# EAGLE design oresat1b-minusz-end-cap (EAGLE 9.6.2)
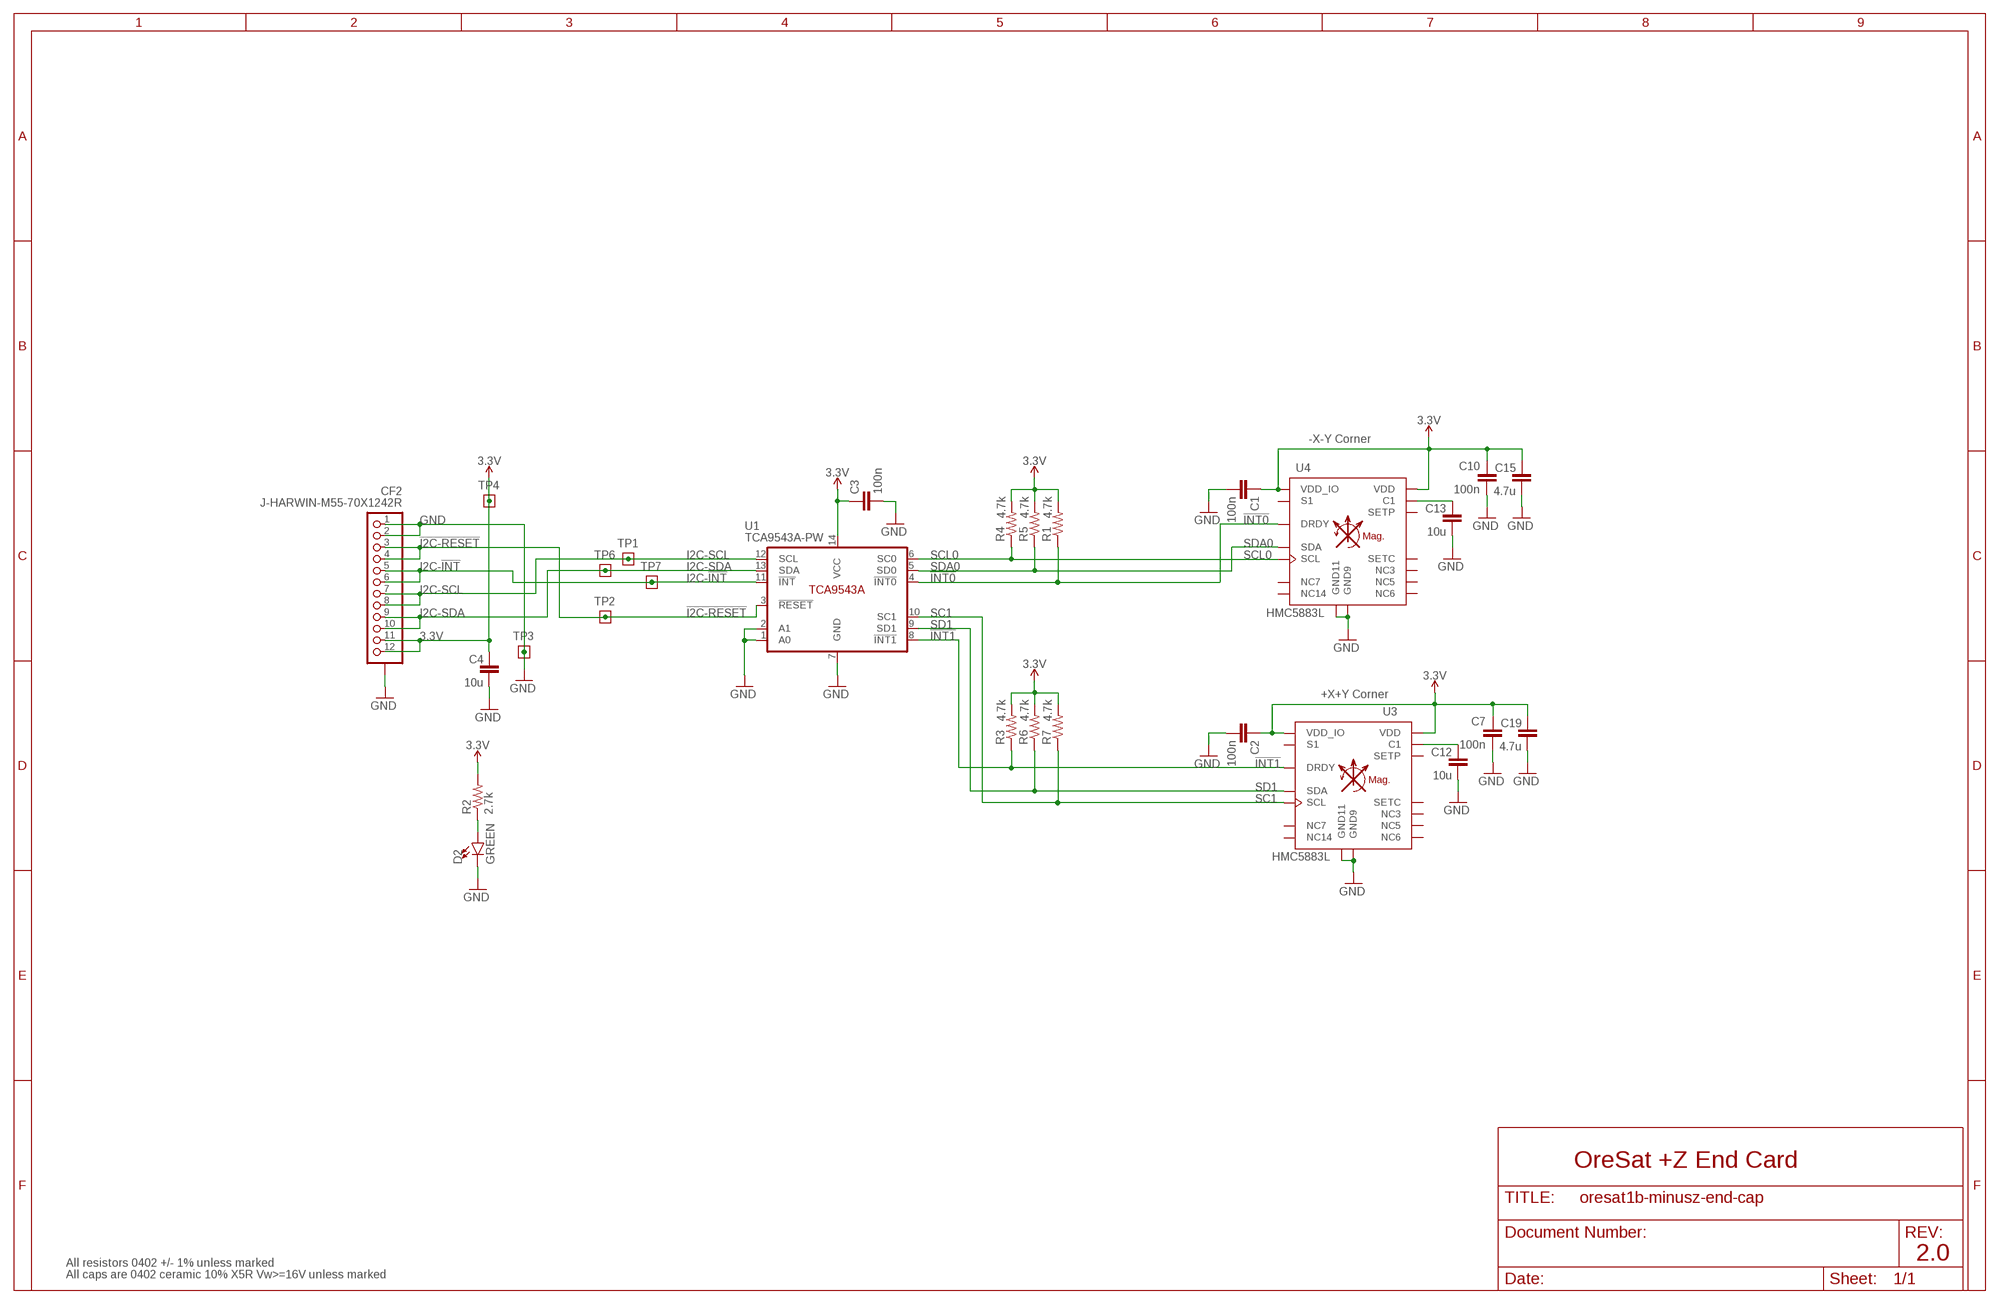
[diagram p0: schematic, sheet 1]

## Parts
C1  100n  C-EU0402-B-NOSILK  [.0402-B-NOSILK]
C2  100n  C-EU0402-B-NOSILK  [.0402-B-NOSILK]
C3  100n  C-EU0402-B-NOSILK  [.0402-B-NOSILK]
C4  10u  C-EU0603-B-NOSILK  [.0603-B-NOSILK]
C7  100n  C-EU0402-B-NOSILK  [.0402-B-NOSILK]
C10  100n  C-EU0402-B-NOSILK  [.0402-B-NOSILK]
C12  10u  C-EU0603-B-NOSILK  [.0603-B-NOSILK]
C13  10u  C-EU0603-B-NOSILK  [.0603-B-NOSILK]
C15  4.7u  C-EU0603-B-NOSILK  [.0603-B-NOSILK]
C19  4.7u  C-EU0603-B-NOSILK  [.0603-B-NOSILK]
CF2  J-HARWIN-M55-70X1242R  [HARWIN-M55-70X1242R]
D2  GREEN  LED-GREEN0603  [LED-0603]
R1  4.7k  R-US_0402-B-NOSILK  [.0402-B-NOSILK]
R2  2.7k  R-US_0402-B-NOSILK  [.0402-B-NOSILK]
R3  4.7k  R-US_0402-B-NOSILK  [.0402-B-NOSILK]
R4  4.7k  R-US_0402-B-NOSILK  [.0402-B-NOSILK]
R5  4.7k  R-US_0402-B-NOSILK  [.0402-B-NOSILK]
R6  4.7k  R-US_0402-B-NOSILK  [.0402-B-NOSILK]
R7  4.7k  R-US_0402-B-NOSILK  [.0402-B-NOSILK]
TP1  TEST-POINT  [2MM-TEST-POINT]
TP2  TEST-POINT  [2MM-TEST-POINT]
TP3  TEST-POINT  [2MM-TEST-POINT]
TP4  TEST-POINT  [2MM-TEST-POINT]
TP6  TEST-POINT  [2MM-TEST-POINT]
TP7  TEST-POINT  [2MM-TEST-POINT]
U1  TCA9543A-PW  [TSSOP14-0.65-5.4X4.4MM]
U3  HMC5883L  HMC5883L-LGA-16  [QLGA-16(3X3)]
U4  HMC5883L  HMC5883L-LGA-16  [QLGA-16(3X3)]

## Nets
3.3V: C1.1 C2.1 C3.1 C4.1 C7.1 C10.1 C15.1 C19.1 CF2.11 CF2.12 R1.2 R2.2 R3.2 R4.2 R5.2 R6.2 R7.2 TP4.1 U1.14(VCC) U3.2(VDD) U3.13(VDD_IO) U4.2(VDD) U4.13(VDD_IO)
!I2C-RESET: CF2.3 CF2.4 TP2.1 U1.3(!RESET)
!INT0: R1.1 U1.4(!INT0) U4.15(DRDY)
!INT1: R3.1 U1.8(!INT1) U3.15(DRDY)
GND: C1.2 C2.2 C3.2 C4.2 C7.2 C10.2 C12.2 C13.2 C15.2 C19.2 CF2.1 CF2.2 CF2.P$1(SHIELDS) CF2.P$2(SHIELDS) CF2.P$3(SHIELDS) CF2.P$4(SHIELDS) D2.C TP3.1 U1.1(A0) U1.2(A1) U1.7(GND) U3.9(GND9) U3.11(GND11) U4.9(GND9) U4.11(GND11)
I2C-!INT: CF2.5 CF2.6 TP7.1 U1.11(!INT)
I2C-SCL: CF2.7 CF2.8 TP1.1 U1.12(SCL)
I2C-SDA: CF2.9 CF2.10 TP6.1 U1.13(SDA)
N$2: C12.1 U3.10(C1)
N$5: C13.1 U4.10(C1)
N$271: D2.A R2.1
SC1: R7.1 U1.10(SC1) U3.1(SCL)
SCL0: R4.1 U1.6(SC0) U4.1(SCL)
SD1: R6.1 U1.9(SD1) U3.16(SDA)
SDA0: R5.1 U1.5(SD0) U4.16(SDA)
Unconnected: U3.3(NC3) U3.4(S1) U3.5(NC5) U3.6(NC6) U3.7(NC7) U3.8(SETP) U3.12(SETC) U3.14(NC14) U4.3(NC3) U4.4(S1) U4.5(NC5) U4.6(NC6) U4.7(NC7) U4.8(SETP) U4.12(SETC) U4.14(NC14)

## Notes on the sheet
- -X-Y Corner
- +X+Y Corner
- OreSat +Z End Card
- 2.0
- All resistors 0402 +/- 1% unless marked
- All caps are 0402 ceramic 10% X5R Vw>=16V unless marked

## Library data of the parts
C1-C3 C7 C10 = rcl_custom:C-EU: CAPACITOR, European symbol; DIS: Digi-Key; DPN: 1276-1001-1-ND; MFR: Samsung; MPN: CL05B104KO5NNNC
C4 C12 C13 C15 C19 = oresat-rcl:C-EU: CAPACITOR, European symbol; DIS: Digi-Key; DPN: 1276-1001-1-ND; MFR: Samsung; MPN: CL05B104KO5NNNC
CF2 = J-Harwin-M55-70X1242R-12pin-1.27mm-M-vertical:J-HARWIN-M55-70X1242R
D2 = SparkFun-LED:LED-GREEN: Green SMD LED Used in manufacturing of various products at SparkFun Packages: 0603 - SMD 0603 package [Product Link] <http://www.futureelectronics.com/en/technologies/semiconductors/optoelectronics/leds/Pages/9894312-LTST-C190GKT.aspx?CrossPart=HSMG-C190&IM=0> LilyPad 1206 - SMD1206 LilyPad package [Product Link] <http://www.futureelectronics.com/en/Technologies/Product.aspx?ProductID=IN150NGHARVATEKCORPORATION2049943&IM=0> 1206 - SMD1206 package [Product Link] <http://www.futureelectronics.com/en/technologies/semiconductors/optoelectronics/leds/Pages/8315665-LTST-C150KGKT.aspx?IM=0> 1206 Bottom Mount -SMD 1206 Bottom Mount [Product Link] <http://www.digikey.com/product-detail/en/lite-on-inc/LTST-C230KGKT/160-1456-1-ND/386854> SparkFun Products: Pro Mini 328 -5V <https://www.sparkfun.com/products/821> RedBoard <https://www.sparkfun.com/products/12757> MP3 Trigger <https://www.sparkfun.com/products/13720> Makey Makey <https://www.sparkfun.com/products/11076>; PROD_ID: DIO-00821
R1-R7 = rcl_custom:R-US_: RESISTOR, American symbol; DIS: Digi-Key; DPN: 1276-4275-1-ND; MFR: Samsung; MPN: RC1005F6653CS
TP1-TP4 TP6 TP7 = Tova:TEST-POINT
U1 = U-TI-TCA9543A-I2C-2-to-1-multiplexer:TCA9543A-PW
U3 U4 = monitor-v2:HMC5883L: Honeywell HMC5883L 3-axis Digital Compass with I2C interface

## Board
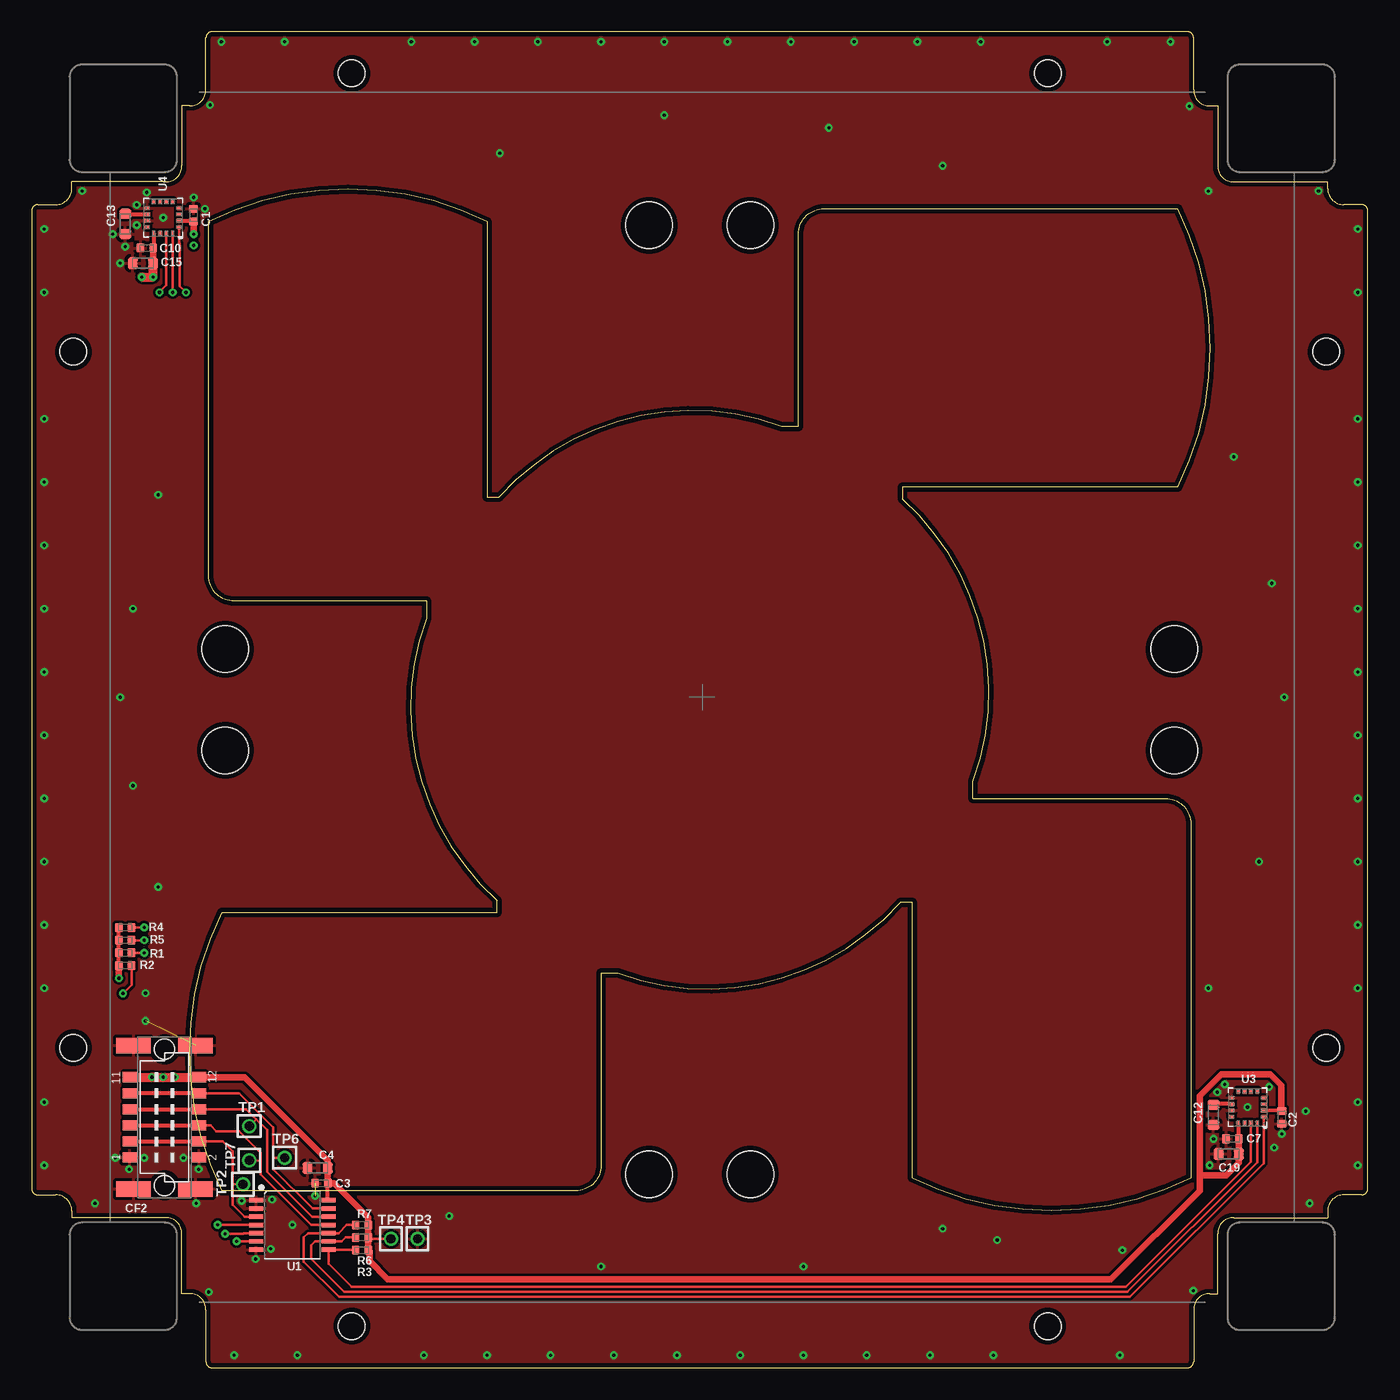
[diagram p1: board, top side]
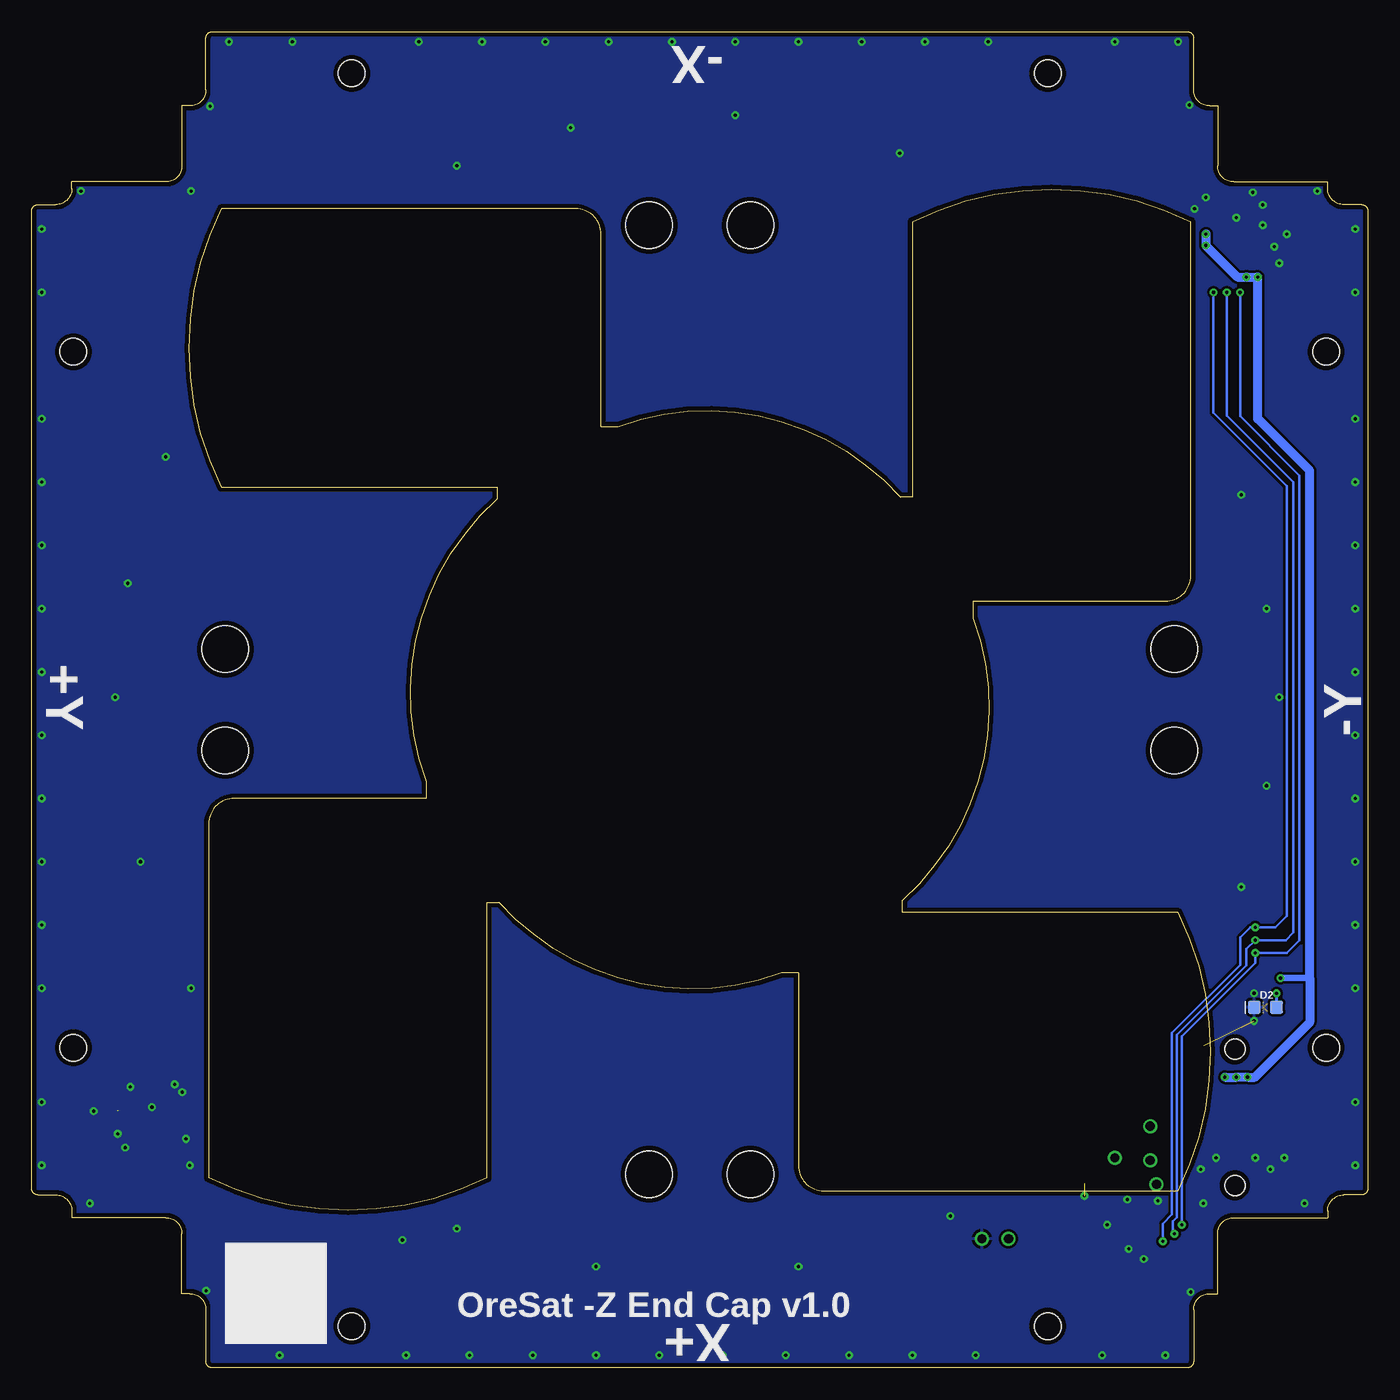
[diagram p2: board, bottom side, seen from below]

Size 105.6 x 105.6 mm. Coordinates in mm from the lower left corner, seen from the top.
Outline: 11.87,99.73 11.87,95 arc-90 10.6,93.73 3.17,93.73 3.17,93.2 arc-90 1.9,91.93 0.5,91.93 arc90 0,91.43 0,14.17 arc90 0.5,13.67 1.9,13.67 arc-90 3.17,12.4 3.17,11.87 10.6,11.87 arc-90 11.87,10.6 11.87,5.87 12.5,5.87 arc-90 13.77,4.6 13.77,0.5 arc90 14.27,0 91.33,0 arc90 91.83,0.5 91.83,4.6 arc-90 93.1,5.87 93.73,5.87 93.73,10.6 arc-90 95,11.87 102.43,11.87 102.43,12.4 arc-90 103.7,13.67 105.1,13.67 arc90 105.6,14.17 105.6,91.43 arc90 105.1,91.93 103.7,91.93 arc-90 102.43,93.2 102.43,93.73 95,93.73 arc-90 93.73,95 93.73,99.73 93.1,99.73 arc-90 91.83,101 91.83,105.1 arc90 91.33,105.6 14.27,105.6 arc90 13.77,105.1 13.77,101 arc-90 12.5,99.73 11.87,99.73
Outline: 69.6,15 69.6,36.8 68.65,36.8 arc-69 46.35,31.2 45,31.2 45,16 arc-90 43,14 15,14 arc-52 15,36 35.5,36 36.8,36 36.8,36.95 arc-69 31.2,59.25 31.2,60.6 16,60.6 arc-90 14,62.6 14,90.6 arc-52 36,90.6 36,68.8 36.95,68.8 arc-69 59.25,74.4 60.6,74.4 60.6,89.6 arc-90 62.6,91.6 90.6,91.6 arc-52 90.6,69.6 68.8,69.6 68.8,68.65 arc-69 74.4,46.35 74.4,45 89.6,45 arc-90 91.6,43 91.6,15 arc-52 69.6,15
Copper layers (1*16): Top 0.0356mm / dielectric 1.5011mm / Bottom 0.0356mm
Design rules "OSH-Park-2-layer *": minimum track width 6mil, minimum drill 10mil, track to track 6mil, track to pad 6mil, pad to pad 6mil, via to via 6mil, smd to smd 6mil, copper to edge 15mil, drill to drill 6mil, minimum pad ring 7mil, minimum via ring 7mil, stop-mask expansion 3mil, vias tented up to drill 13mil, thermal gap 10mil
Holes 3.7 mm at 48.8,90.3 56.8,90.3 90.3,56.8 90.3,48.8 56.8,15.3 48.8,15.3 15.3,48.8 15.3,56.8
Holes 2.1 mm at 102.3,80.3 102.3,25.3 80.3,3.3 25.3,3.3 3.3,25.3 3.3,80.3 25.3,102.3 80.3,102.3

### Footprints (pad centres in the part's own frame; a part is rotated, then mirrored left to right if it is on the bottom)
.0402-B-NOSILK = smd 0.6 x 0.7: 1 -0.5,0; 2 0.5,0
.0603-B-NOSILK = smd 0.8 x 0.95: 1 -0.8,0; 2 0.8,0
HARWIN-M55-70X1242R = smd 0.8 x 1.1: 1 3.175,-2.75; 2 3.175,2.75; 3 1.905,-2.75; 4 1.905,2.75; 5 0.635,-2.75; 6 0.635,2.75; 7 -0.635,-2.75; 8 -0.635,2.75; 9 -1.905,-2.75; 10 -1.905,2.75; 11 -3.175,-2.75; 12 -3.175,2.75 | smd 1.2 x 2.7: P$1 -5.67,-2.45; P$2 -5.67,2.45; P$3 5.67,2.45; P$4 5.67,-2.45 | hole 1.6: -5.385,0; 5.385,0
LED-0603 = smd 1 x 1: A -0.877,0; C 0.877,0
2MM-TEST-POINT = drill 0.737: 1 0,0
TSSOP14-0.65-5.4X4.4MM = smd 0.35 x 1.1: 1 -1.95,-2.86; 2 -1.3,-2.86; 3 -0.65,-2.86; 4 0,-2.86; 5 0.65,-2.86; 6 1.3,-2.86; 7 1.95,-2.86; 8 1.95,2.86; 9 1.3,2.86; 10 0.65,2.86; 11 0,2.86; 12 -0.65,2.86; 13 -1.3,2.86; 14 -1.95,2.86
QLGA-16(3X3) = smd 0.45 x 0.3: 1 -1.275,0.75; 2 -1.275,0.25; 3 -1.275,-0.25; 4 -1.275,-0.75; 9 1.275,-0.75; 10 1.275,-0.25; 11 1.275,0.25; 12 1.275,0.75 | smd 0.3 x 0.45: 5 -0.75,-1.275; 6 -0.25,-1.275; 7 0.25,-1.275; 8 0.75,-1.275; 13 0.75,1.275; 14 0.25,1.275; 15 -0.25,1.275; 16 -0.75,1.275

### Placement (x,y rotation side)
C1  12.8,91.1 90 top
C2  98.8,19.8 270 top
C3  22.9,14.6 180 top
C4  22.6,15.8 180 top
C7  94.9,18.1 180 top
C10  9.1,88.5 180 top
C12  93.4,20 270 top
C13  7.4,90.4 270 top
C15  8.8,87.3 180 top
C19  94.6,16.9 180 top
CF2  10.5,19.8 270 top
D2  8.1,28.5 180 bottom
R1  7.4,32.8 180 top
R2  7.4,31.8 180 top
R3  26.1,9.3 0 top
R4  7.4,34.8 180 top
R5  7.4,33.8 180 top
R6  26.1,10.3 0 top
R7  26.1,11.3 0 top
TP1  17.2,19.1 270 top
TP2  16.7,14.5 0 top
TP3  30.5,10.2 0 top
TP4  28.4,10.2 0 top
TP6  20,16.6 270 top
TP7  17.2,16.4 0 top
U1  20.6,11.3 270 top
U3  96.1,20.6 180 top
U4  10.4,90.9 180 top

### Tracks (layer width: path | path; a pad name or v marks a point on that pad's centre or on a via)
3.3V  (via drill 0.25)  (2 unrouted)
  Top 0.2: TP4.1 26.7,10.2 R6.2
  Top 0.3: U3.13 95.35,18.15 C7.1 | U3.2 98.8,20.32 | U4.13 9.65,88.55 C10.1 | U4.2 12.75,90.65 C1.1 | R2.2 R1.2 R5.2 R4.2 | U1.14 23.4,13.31 C3.1
  Top 0.5: C7.1 C19.1 95.4,16.2 94.4,15.2 92.3,15.2 92.3,15.3 | 98.78,20.3 98.78,22.32 97.9,23.2 94,23.2 92.3,21.5 92.3,15.3 | C15.1 C10.1 | C1.1 v12.8,89.6 | 92.3,15.3 92.3,14 85.3,7 28.15,7 26.7,8.45 26.7,9.2 R3.2 R6.2 R7.2 26.6,11.9 23.9,14.6 C3.1 C4.1 23.4,16.4 16.82,22.98 CF2.12 | v6.9,30.8 R2.2
  Top 0.7: C15.1 v9.6,86.2 v8.7,86.2 | CF2.11 v9.5,22.98 | CF2.12 v11.3,22.98 9.55,22.98
  Bottom 0.5: 4.6,30.8 v6.9,30.8
  Bottom 0.7: v12.8,89.6 v12.8,88.7 10.3,86.2 v9.6,86.2 v8.7,86.2 8.7,75 4.6,70.9 4.6,30.8 4.6,27.3 8.93,22.98 v9.5,22.98 v10.4,22.98 v11.3,22.98
!I2C-RESET
  Top 0.152: TP2.1 15.9,14.5
  Top 0.2: U1.3 16.85,11.95 15.9,12.9 15.9,14.5 15.9,17.1 15.11,17.89 CF2.4
  Top 0.3: CF2.3 CF2.4
!INT0  (via drill 0.25)
  Top 0.2: U4.15 10.65,85.55 v10.1,85 | v14.7,11.3 U1.4 | v8.9,32.8 R1.1
  Bottom 0.2: v14.7,11.3 14.7,26.2 8.9,32 v8.9,32.8 6.4,32.8 5.4,33.8 5.4,70.5 10.1,75.2 v10.1,85 10.1,83.1
!INT1
  Top 0.2: U3.15 96.35,16.29 86.46,6.4 74.6,6.4 74.5,6.4 25.3,6.4 23.46,8.24 U1.8 25.55,9.35
  Top 0.3: 25.55,9.35 R3.1
GND  (via drill 0.25)  (2 unrouted)
  other vias: 96.1,20.6 94.3,22.4 93.4,18.1 97.8,22.2 93.1,16 86.2,9.3 98.8,18.5 98.2,17.4 76.3,10.1 20.6,11.3 9,29.62 9,27.42 1,16 1,21 1,30 1,35 1,40 1,45 1,50 1,55 1,60 1,65 1,70 1,75 1,90 1,85 104.8,16 104.8,21 104.8,30 104.8,35 104.8,40 104.8,45 104.8,50 104.8,55 104.8,60 104.8,65 104.8,70 104.8,75 104.8,90 104.8,85 15,104.8 20,104.8 30,104.8 35,104.8 40,104.8 45,104.8 50,104.8 55,104.8 60,104.8 65,104.8 70,104.8 75,104.8 85,104.8 90,104.8 16,1 21,1 31,1 36,1 41,1 46,1 51,1 56,1 61,1 66,1 71,1 76,1 86,1 10,38 10,69 37,96 50,99 63,98 72,95 95,72 98,62 99,53 97,40 93,30 72,11 61,8 33,12 10.4,90.9 12.8,92.5 13.7,91.6 6.4,89.6 7.4,88.6 8.3,90.3 7,87.3 8.3,91.9 9.1,92.9 100.7,20.3 93.7,21.8 4,93 14.1,99.8 91.5,99.7 93,93 101.7,93 101,13 91.8,6.1 14,6 13,13 5,13 12,16.6 13.2,15.7 6.6,16.6 7.7,15.7 8.9,16.6 8,60 45,8 8,46 7,53 17.7,8.6 18.9,9.4 16.6,13.2 19,13.3 22.4,13.6
  pour Top (isolate 0.2, rank 6): 0,0 105.6,0 105.6,105.6 0,105.6
  pour Bottom (isolate 0.2, rank 6): 0,0 105.6,0 105.6,105.6 0,105.6
I2C-!INT
  Top 0.152: TP7.1 18.1,16.4
  Top 0.2: U1.11 22.1,11.3 18.1,15.3 18.1,16.4 18.1,17 16.4,18.7 14.6,18.7 14.13,19.16 CF2.6
  Top 0.3: CF2.5 CF2.6
I2C-SCL
  Top 0.2: U1.12 22.15,11.95 18.6,15.5 18.6,18.8 17.75,19.65 | 17.75,19.65 16.96,20.43 CF2.8 | TP1.1 17.75,19.65
  Top 0.3: CF2.7 CF2.8
I2C-SDA
  Top 0.2: U1.13 22.2,12.6 19.1,15.7 19.1,16.6 | 19.1,16.6 19.1,19 16.39,21.7 CF2.10 | TP6.1 19.1,16.6
  Top 0.3: CF2.10 CF2.9
N$2
  Top 0.2: 93.45,20.85 C12.1
  Top 0.3: U3.10 93.45,20.85
N$5
  Top 0.3: U4.10 7.45,91.15 C13.1
N$271  (via drill 0.25)
  Top 0.2: v7.22,29.59 7.9,30.27 R2.1
  Bottom 0.25: v7.22,29.59 D2.A
SC1
  Top 0.2: U3.1 97.38,16.18 86.8,5.6 24.3,5.6 21.5,8.4 21.5,10.3 21.85,10.65 U1.10 24.25,10.65 24.9,11.3 R7.1
SCL0  (via drill 0.25)
  Top 0.2: U4.1 11.68,88.92 11.7,88.9 11.7,85.5 v12.2,85 | v8.9,34.8 R4.1 | U1.6 v16.2,10 v16.2,9.99
  Bottom 0.2: v16.2,9.99 16.2,11.4 15.48,12.12 15.48,26.46 10.1,31.84 10.1,34 9.3,34.8 v8.9,34.8 7.3,34.8 6.4,35.7 6.4,69.7 12.2,75.5 12.2,83 | v12.2,85 12.2,83 | 12.2,83 12.2,82.8
SD1
  Top 0.2: U3.16 96.85,16.25 86.6,6 74,6 73.9,6 24.7,6 22.1,8.6 22.1,9.7 22.4,10 U1.9 24.5,10 24.8,10.3 R6.1
SDA0  (via drill 0.25)
  Top 0.2: U1.5 16.75,10.65 16.7,10.6 v15.3,10.6 | v11.15,85 U4.16 | v8.9,33.8 R5.1
  Bottom 0.2: v15.3,10.6 15.4,10.7 15.4,11.6 15.1,11.9 15.1,26.3 9.6,31.8 9.6,33.1 v8.9,33.8 6.5,33.8 5.9,34.4 5.9,70 11.15,75.25 v11.15,85

### Text on the board
bPlace: -X | +Y | -Y | OreSat -Z End Cap v1.0 | +X